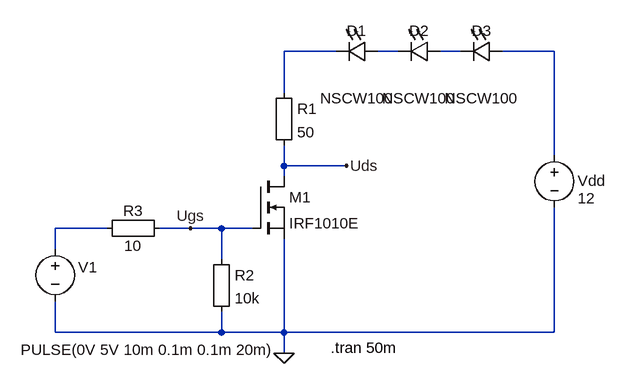
[diagram p0: schematic LED-DRV.asc]
LED-DRV.asc, the LTspice schematic file:
Version 4
SHEET 1 1292 680
WIRE -640 -288 -720 -288
WIRE -544 -288 -576 -288
WIRE -448 -288 -480 -288
WIRE -304 -288 -384 -288
WIRE -720 -224 -720 -288
WIRE -304 -128 -304 -288
WIRE -720 -112 -720 -144
WIRE -624 -112 -720 -112
WIRE -720 -96 -720 -112
WIRE -992 -16 -1072 -16
WIRE -864 -16 -912 -16
WIRE -816 -16 -864 -16
WIRE -768 -16 -816 -16
WIRE -1072 16 -1072 -16
WIRE -816 32 -816 -16
WIRE -1072 144 -1072 96
WIRE -816 144 -816 112
WIRE -816 144 -1072 144
WIRE -720 144 -720 0
WIRE -720 144 -816 144
WIRE -304 144 -304 -48
WIRE -304 144 -720 144
WIRE -720 176 -720 144
FLAG -720 176 0
FLAG -624 -112 Uds
FLAG -864 -16 Ugs
SYMBOL voltage -304 -144 R0
WINDOW 123 0 0 Left 2
WINDOW 39 37 60 Left 2
WINDOW 0 36 55 Left 2
WINDOW 3 36 82 Left 2
SYMATTR InstName Vdd
SYMATTR Value 12
SYMBOL voltage -1072 0 R0
WINDOW 123 0 0 Left 2
WINDOW 3 -53 171 Left 2
WINDOW 0 35 44 Left 2
SYMATTR Value PULSE(0V 5V 10m 0.1m 0.1m 20m)
SYMATTR InstName V1
SYMATTR SpiceLine Rser=10m
SYMBOL nmos -768 -96 R0
SYMATTR InstName M1
SYMATTR Value IRF1010E
SYMBOL Misc\\EuropeanResistor -736 -240 R0
SYMATTR InstName R1
SYMATTR Value 50
SYMBOL LED -576 -304 R90
WINDOW 0 0 32 VBottom 2
WINDOW 3 72 32 VTop 2
SYMATTR InstName D1
SYMATTR Value NSCW100
SYMATTR Description Diode
SYMATTR Type diode
SYMBOL LED -480 -304 R90
WINDOW 0 0 32 VBottom 2
WINDOW 3 72 32 VTop 2
SYMATTR InstName D2
SYMATTR Value NSCW100
SYMATTR Description Diode
SYMATTR Type diode
SYMBOL LED -384 -304 R90
WINDOW 0 0 32 VBottom 2
WINDOW 3 72 32 VTop 2
SYMATTR InstName D3
SYMATTR Value NSCW100
SYMATTR Description Diode
SYMATTR Type diode
SYMBOL Misc\\EuropeanResistor -832 16 R0
SYMATTR InstName R2
SYMATTR Value 10k
SYMBOL Misc\\EuropeanResistor -896 -32 R90
WINDOW 0 5 56 VBottom 2
WINDOW 3 27 56 VTop 2
SYMATTR InstName R3
SYMATTR Value 10
TEXT -648 168 Left 2 !.tran 50m

The netlist it stands for:
* LED-DRV.asc
Vdd N004 0 12
V1 N005 0 PULSE(0V 5V 10m 0.1m 0.1m 20m) Rser=10m
M1 Uds Ugs 0 0 IRF1010E
R1 N001 Uds 50
D1 N002 N001 NSCW100
D2 N003 N002 NSCW100
D3 N004 N003 NSCW100
R2 Ugs 0 10k
R3 Ugs N005 10
.model D D
.lib standard.dio
.model NMOS NMOS
.model PMOS PMOS
.lib standard.mos
.tran 50m
.backanno
.end